# EasyEDA schematic SmartLightsMini.json
TITLE: Smart Lights (MINI); REV: 1.4; Date: 2022-04-09; Sheet: 1/1; Drawn By: VictorAlicino; Company: ALICINO
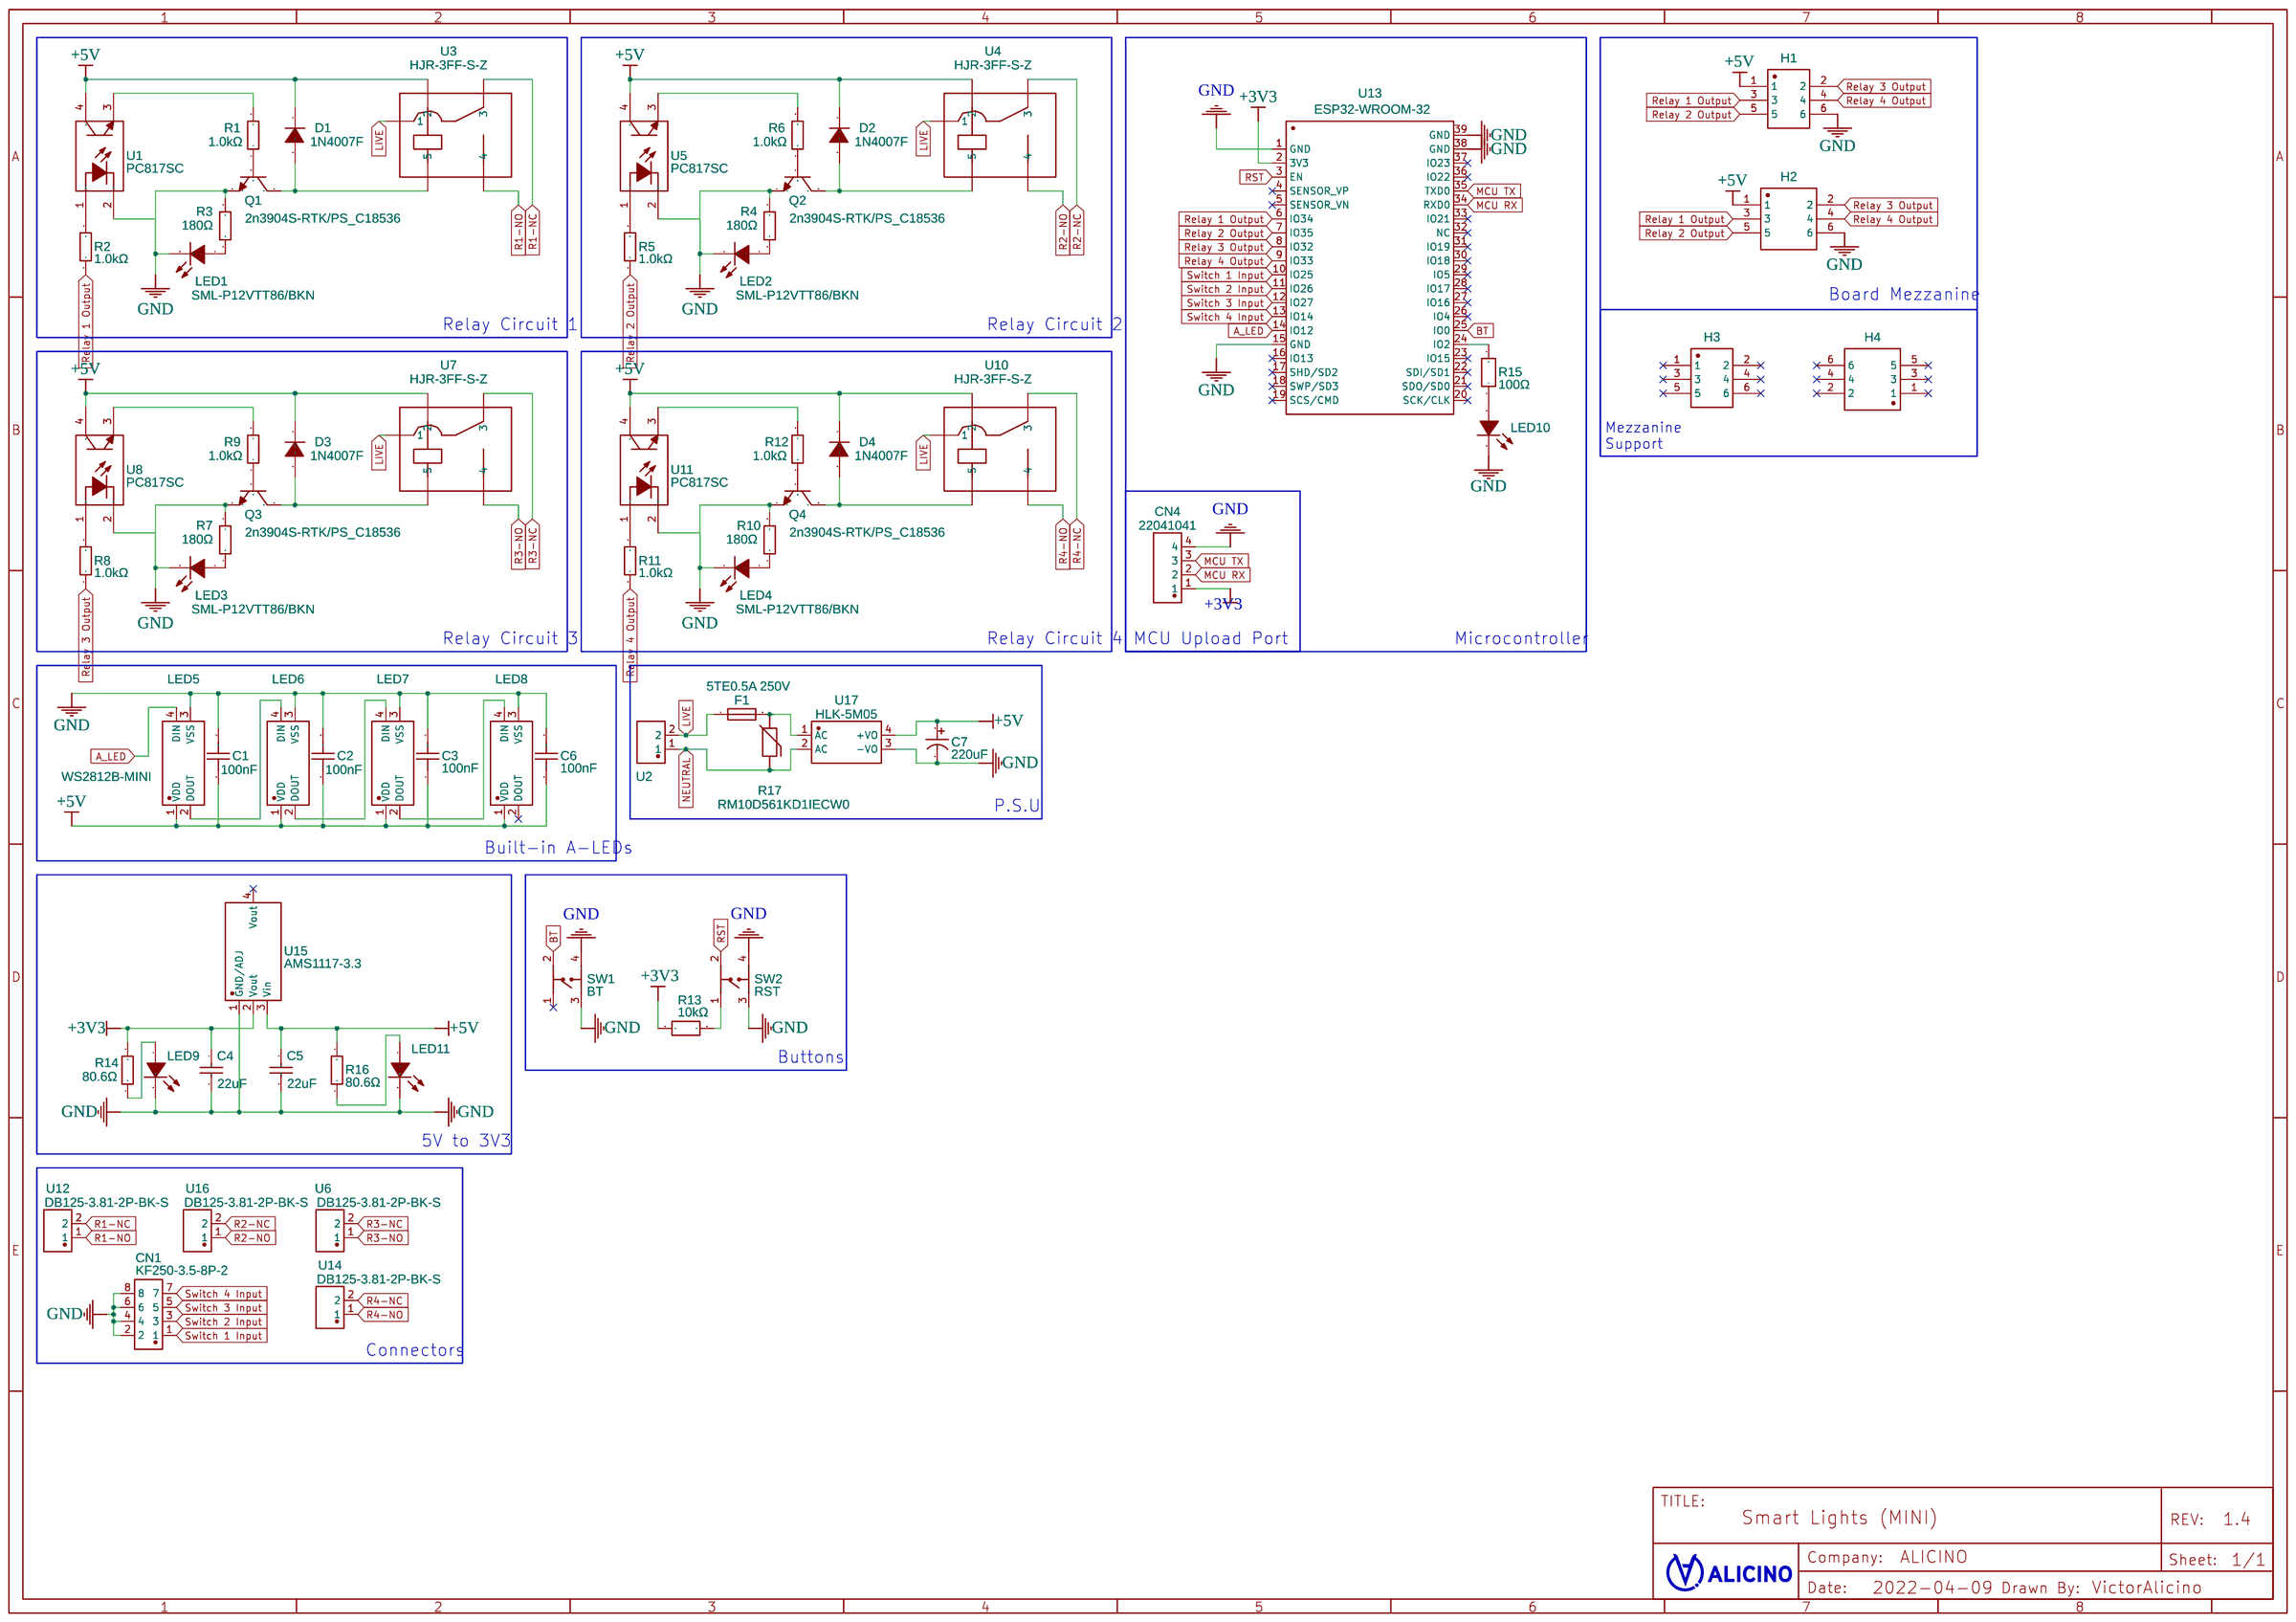
[diagram p0: schematic sheet]

## Parts
C1  100nF  [C0603]
C2  100nF  [C0603]
C3  100nF  [C0603]
C4  22uF  [C0603]
C5  22uF  [C0603]
C6  100nF  [C0603]
C7  220uF  [CAP-SMD_BD10.0-L10.3-W10.3-FD]
CN1  KF250-3.5-8P-2  [CONN-TH_8P-P3.50_KF250-3.5-8P-2]
CN4  22041041  [CONN-TH_22041041-1]
D1  1N4007F  [SMAF_L3.5-W2.6-LS4.7-RD]
D2  1N4007F  [SMAF_L3.5-W2.6-LS4.7-RD]
D3  1N4007F  [SMAF_L3.5-W2.6-LS4.7-RD]
D4  1N4007F  [SMAF_L3.5-W2.6-LS4.7-RD]
F1  5TE0.5A 250V  [FUSE-TH_L8.5-W4.0-P5.08-D0.6]
H1  210SMT-2*3P Gold-plated black  [HDR-SMD_6P-P2.54-V-M-R2-C3-S2.54-LS7.3]
H2  220S-2*3P H=8.5MM Ytype Gold-plated  [HDR-TH_6P-P2.54-V-F-R2-C3-S2.54]
H3  210SMT-2*3P Gold-plated black  [HDR-SMD_6P-P2.54-V-M-R2-C3-S2.54-LS7.3]
H4  220S-2*3P H=8.5MM Ytype Gold-plated  [HDR-TH_6P-P2.54-V-F-R2-C3-S2.54]
LED1  SML-P12VTT86/BKN  [LED0402-R-RD_RED]
LED2  SML-P12VTT86/BKN  [LED0402-R-RD_RED]
LED3  SML-P12VTT86/BKN  [LED0402-R-RD_RED]
LED4  SML-P12VTT86/BKN  [LED0402-R-RD_RED]
LED5  WS2812B-MINI  [LED-SMD_4P-L3.5-W3.5-TL_WS2812B]
LED6  WS2812B-MINI  [LED-SMD_4P-L3.5-W3.5-TL_WS2812B]
LED7  WS2812B-MINI  [LED-SMD_4P-L3.5-W3.5-TL_WS2812B]
LED8  WS2812B-MINI  [LED-SMD_4P-L3.5-W3.5-TL_WS2812B]
LED9  SML-P12VTT86/BKN  [LED0402-R-RD_RED]
LED10  19-21UYC/S530-A2/TR8  [LED0603-R-RD_YELLOW]
LED11  SML-P12VTT86/BKN  [LED0402-R-RD_RED]
Q1  2n3904S-RTK/PS_C18536  [SOT-23-3_L2.9-W1.3-P1.90-LS2.4-TR]
Q2  2n3904S-RTK/PS_C18536  [SOT-23-3_L2.9-W1.3-P1.90-LS2.4-TR]
Q3  2n3904S-RTK/PS_C18536  [SOT-23-3_L2.9-W1.3-P1.90-LS2.4-TR]
Q4  2n3904S-RTK/PS_C18536  [SOT-23-3_L2.9-W1.3-P1.90-LS2.4-TR]
R1  1.0kΩ  [R0603]
R2  1.0kΩ  [R0603]
R3  180Ω  [R0603]
R4  180Ω  [R0603]
R5  1.0kΩ  [R0603]
R6  1.0kΩ  [R0603]
R7  180Ω  [R0603]
R8  1.0kΩ  [R0603]
R9  1.0kΩ  [R0603]
R10  180Ω  [R0603]
R11  1.0kΩ  [R0603]
R12  1.0kΩ  [R0603]
R13  10kΩ  [R0603]
R14  80.6Ω  [R0603]
R15  100Ω  [R0603]
R16  80.6Ω  [R0603]
R17  RM10D561KD1IECW0  [RES-TH_L13.0-W6.5-P7.50-D1.2]
SW1  BT  [SW-SMD_4P-L6.0-W6.0-P4.50-LS8.6]
SW2  RST  [SW-SMD_4P-L6.0-W6.0-P4.50-LS8.6]
U1  PC817SC  [OPTO-SMD-4_L4.6-W6.5-P2.54-LS10.3-TL]
U2  DB125-3.81-2P-RD  [CONN-TH_DB125-3.81-2P-RD]
U3  HJR-3FF-S-Z  [HJR-3FF-S-Z 5V]
U4  HJR-3FF-S-Z  [HJR-3FF-S-Z 5V]
U5  PC817SC  [OPTO-SMD-4_L4.6-W6.5-P2.54-LS10.3-TL]
U6  DB125-3.81-2P-BK-S  [CONN-TH_2P-P3.81_DB125-3.81-2P-BK-S]
U7  HJR-3FF-S-Z  [HJR-3FF-S-Z 5V]
U8  PC817SC  [OPTO-SMD-4_L4.6-W6.5-P2.54-LS10.3-TL]
U10  HJR-3FF-S-Z  [HJR-3FF-S-Z 5V]
U11  PC817SC  [OPTO-SMD-4_L4.6-W6.5-P2.54-LS10.3-TL]
U12  DB125-3.81-2P-BK-S  [CONN-TH_2P-P3.81_DB125-3.81-2P-BK-S]
U13  ESP32-WROOM-32  [WIFIM-SMD_ESP-32S]
U14  DB125-3.81-2P-BK-S  [CONN-TH_2P-P3.81_DB125-3.81-2P-BK-S]
U15  AMS1117-3.3  [SOT-223-3_L6.5-W3.4-P2.30-LS7.0-BR]
U16  DB125-3.81-2P-BK-S  [CONN-TH_2P-P3.81_DB125-3.81-2P-BK-S]
U17  HLK-5M05  [PWRM-TH_HLK-5M05]

## Library data of the parts
C1-C3 C6 = 06035C104KAZ2A: Supplier: LCSC; Supplier Part: C212614; Manufacturer: AVX; Contributor: LCSC; JLCPCB Part Class: Extended Part
C4 C5 = 06036D226MAT2A: Supplier: LCSC; Manufacturer: AVX; Supplier Part: C140720; JLCPCB Part Class: Extended Part
C7 = EEEHA1C221AP: Supplier: LCSC; Supplier Part: C336793; Manufacturer: PANASONIC; Contributor: LCSC; JLCPCB Part Class: Extended Part
CN1 = KF250-3.5-8P-2: Supplier: LCSC; Supplier Part: C475169; Manufacturer: Cixi Kefa Elec; Contributor: LCSC; JLCPCB Part Class: Extended Part
CN4 = 22041041: Supplier: LCSC; Supplier Part: C185196; Manufacturer: MOLEX; Contributor: LCSC; JLCPCB Part Class: Extended Part
D1-D4 = 1N4007F: Supplier: LCSC; Manufacturer: SK; Supplier Part: C110856; JLCPCB Part Class: Extended Part
F1 = 5TE0.5A 250V: Supplier: LCSC; Supplier Part: C140483; Manufacturer: XC Elec(Shenzhen); Contributor: LCSC; JLCPCB Part Class: Extended Part
H1 H3 = 210SMT-2*3P Gold-plated black: Supplier: LCSC; Manufacturer: Ckmtw; Contributor: LCSC; Supplier Part: C124390; JLCPCB Part Class: Extended Part
H2 H4 = 220S-2*3P H=8.5MM Ytype Gold-plated: Supplier: LCSC; Manufacturer: Ckmtw; Contributor: LCSC; Supplier Part: C124421; JLCPCB Part Class: Extended Part
LED1-LED4 LED9 LED11 = SML-P12VTT86/BKN: Supplier: LCSC; Supplier Part: C184649; Manufacturer: ROHM Semicon; Contributor: LCSC; JLCPCB Part Class: Extended Part
LED5-LED8 = WS2812B-MINI: Supplier: LCSC; Supplier Part: C527089; Manufacturer: Worldsemi; Manufacturer Part: WS2812B-Mini; Contributor: LCSC; JLCPCB Part Class: Extended Part
LED10 = 19-21UYC/S530-A2/TR8: Supplier: LCSC; Supplier Part: C90109; Manufacturer: Everlight Elec; Contributor: LCSC; JLCPCB Part Class: Extended Part
Q1-Q4 = 2n3904S-RTK/PS_C18536: Supplier: LCSC; Manufacturer: KEC; Manufacturer Part: 2n3904S-RTK/PS; Supplier Part: C18536; JLCPCB Part Class: Extended Part
R1 R2 R5 R6 R8 R9 R11 R12 = AECR0603F1K00K9: Supplier: LCSC; Supplier Part: C328340; Manufacturer: ResistorToday; Resistance (Ohms): 1K; Contributor: LCSC; JLCPCB Part Class: Extended Part
R3 R4 R7 R10 = AECR0603F180RK9: Supplier: LCSC; Supplier Part: C352360; Manufacturer: ResistorToday; Resistance (Ohms): 180; Contributor: LCSC; JLCPCB Part Class: Extended Part
R13 = PTFR0603D10K0P9: Supplier: LCSC; Supplier Part: C375971; Manufacturer: ResistorToday; Resistance (Ohms): 10K; Contributor: LCSC; JLCPCB Part Class: Extended Part
R14 R16 = HPCR0603F80R6K9: Supplier: LCSC; Supplier Part: C365216; Manufacturer: ResistorToday; Resistance (Ohms): 80.6; Contributor: LCSC; JLCPCB Part Class: Extended Part
R15 = PTFR0603B100RN9: Supplier: LCSC; Supplier Part: C394538; Manufacturer: ResistorToday; Contributor: LCSC; Resistance (Ohms): 100; JLCPCB Part Class: Extended Part
R17 = RM10D561KD1IECW0: Supplier: LCSC; Supplier Part: C253970; Manufacturer: Dersonic; Contributor: LCSC; JLCPCB Part Class: Extended Part
SW1 SW2 = TSD003A04526A02: Supplier: LCSC; Supplier Part: C2888576; Manufacturer: BZCN(博众电气); Contributor: LCSC; JLCPCB Part Class: Extended Part
U1 U5 U8 U11 = PC817SC: Supplier: LCSC; Supplier Part: C115502; Manufacturer: Wuxi China Resources Huajing Microelectronics; Contributor: LCSC; JLCPCB Part Class: Extended Part
U2 = DB125-3.81-2P-RD: Supplier: LCSC; Supplier Part: C881703; Manufacturer: DIBO; Contributor: LCSC; JLCPCB Part Class: Extended Part
U3 U4 U7 U10 = HJR-3FF-S-Z: Manufacturer: TBO; Manufacturer Part: 1366512; Supplier Part: 1366512; Supplier: Conrad; link: https://www.conrad.at/de/p/tianbo-electronics-hjr-3ff-s-z-5vdc-printrelais-5-v-dc-15-a-1-wechsler-1-st-1366512.html; Contributor: deathstepdspw
U6 U12 U14 U16 = DB125-3.81-2P-BK-S: Supplier: LCSC; Supplier Part: C430618; Manufacturer: DIBO; Contributor: LCSC; JLCPCB Part Class: Extended Part
U13 = ESP32-WROOM-32: Supplier: LCSC; Supplier Part: C82899; Manufacturer: Espressif Systems; Contributor: LCSC; JLCPCB Part Class: Extended Part
U15 = AMS1117-3.3: sourceId: dwIGgezVh; Supplier: LCSC; Manufacturer: AMS; Supplier Part: C6186; JLCPCB Part Class: Basic Part
U17 = HLK-5M05: Supplier: LCSC; Supplier Part: C209907; Manufacturer: HI-LINK; Contributor: LCSC; JLCPCB Part Class: Extended Part

## Nets
+3V3: C4.1 CN4.1 R13.1 R14.2 U13.2(3V3) U15.2(Vout)
+5V: C1.1 C2.1 C3.1 C5.2 C6.1 C7.1 D1.1(C) D2.1(C) D3.1(C) D4.1(C) H1.1 H2.1 LED5.1(VDD) LED6.1(VDD) LED7.1(VDD) LED8.1(VDD) R16.2 U1.4(COL) U3.2 U4.2 U5.4(COL) U7.2 U8.4(COL) U10.2 U11.4(COL) U15.3(Vin) U17.4(+VO)
GND: C1.2 C2.2 C3.2 C4.2 C5.1 C6.2 C7.2 CN1.2 CN1.4 CN1.6 CN1.8 CN4.4 H1.6 H2.6 LED1.2(C) LED2.2(C) LED3.2(C) LED4.2(C) LED5.3(VSS) LED6.3(VSS) LED7.3(VSS) LED8.3(VSS) LED9.2(C) LED10.2(K) LED11.2(C) Q1.1(E) Q2.1(E) Q3.1(E) Q4.1(E) R3.2 R4.2 R7.2 R10.2 SW1.3 SW1.4 SW2.3 SW2.4 U1.2(CAT) U5.2(CAT) U8.2(CAT) U11.2(CAT) U13.1(GND) U13.15(GND) U13.38(GND) U13.39(GND) U15.1(GND/ADJ) U17.3(-VO)
A_LED: LED5.4(DIN) U13.14(IO12)
BT: SW1.2 U13.25(IO0)
LIVE: F1.1 U2.2 U3.1 U4.1 U7.1 U10.1
MCU RX: CN4.2 U13.34(RXD0)
MCU TX: CN4.3 U13.35(TXD0)
NEUTRAL: R17.1 U2.1 U17.2(AC)
R1-NC: U3.3 U12.2
R1-NO: U3.4 U12.1
R2-NC: U4.3 U16.2
R2-NO: U4.4 U16.1
R3-NC: U6.2 U7.3
R3-NO: U6.1 U7.4
R4-NC: U10.3 U14.2
R4-NO: U10.4 U14.1
Relay 1 Output: H1.3 H2.3 R2.1 U13.6(IO34)
Relay 2 Output: H1.5 H2.5 R5.1 U13.7(IO35)
Relay 3 Output: H1.2 H2.2 R8.1 U13.8(IO32)
Relay 4 Output: H1.4 H2.4 R11.1 U13.9(IO33)
RST: SW2.2 U13.3(EN)
Switch 1 Input: CN1.1 U13.10(IO25)
Switch 2 Input: CN1.3 U13.11(IO26)
Switch 3 Input: CN1.5 U13.12(IO27)
Switch 4 Input: CN1.7 U13.13(IO14)
Net-(D1-2): D1.2(A) Q1.3(C) U3.5
Net-(D2-2): D2.2(A) Q2.3(C) U4.5
Net-(D3-2): D3.2(A) Q3.3(C) U7.5
Net-(D4-2): D4.2(A) Q4.3(C) U10.5
Net-(F1-2): F1.2 R17.2 U17.1(AC)
Net-(LED1-1): LED1.1(A) R3.1
Net-(LED2-1): LED2.1(A) R4.1
Net-(LED3-1): LED3.1(A) R7.1
Net-(LED4-1): LED4.1(A) R10.1
Net-(LED5-2): LED5.2(DOUT) LED6.4(DIN)
Net-(LED6-2): LED6.2(DOUT) LED7.4(DIN)
Net-(LED7-2): LED7.2(DOUT) LED8.4(DIN)
Net-(LED9-1): LED9.1(A) R14.1
Net-(LED10-1): LED10.1(A) R15.1
Net-(LED11-1): LED11.1(A) R16.1
Net-(Q1-2): Q1.2(B) R1.1
Net-(Q2-2): Q2.2(B) R6.1
Net-(Q3-2): Q3.2(B) R9.1
Net-(Q4-2): Q4.2(B) R12.1
Net-(R1-2): R1.2 U1.3(EM)
Net-(R2-2): R2.2 U1.1(AN)
Net-(R5-2): R5.2 U5.1(AN)
Net-(R6-2): R6.2 U5.3(EM)
Net-(R8-2): R8.2 U8.1(AN)
Net-(R9-2): R9.2 U8.3(EM)
Net-(R11-2): R11.2 U11.1(AN)
Net-(R12-2): R12.2 U11.3(EM)
Net-(R13-2): R13.2 SW2.1
Net-(R15-2): R15.2 U13.24(IO2)

Not connected (* = marked no-connect by the designer): H3 1* 2* 3* 4* 5* 6*; H4 1* 2* 3* 4* 5* 6*; LED8 2(DOUT)*; SW1 1*; U13 4(SENSOR_VP)* 5(SENSOR_VN)* 16(IO13)* 17(SHD/SD2)* 18(SWP/SD3)* 19(SCS/CMD)* 20(SCK/CLK)* 21(SDO/SD0)* 22(SDI/SD1)* 23(IO15)* 26(IO4)* 27(IO16)* 28(IO17)* 29(IO5)* 30(IO18)* 31(IO19)* 32(NC)* 33(IO21)* 36(IO22)* 37(IO23)*; U15 4(Vout)*

## Notes on the sheet
- Board Mezzanine
- Relay Circuit 1
- Relay Circuit 2
- Mezzanine
  Support
- Relay Circuit 3
- Relay Circuit 4
- MCU Upload Port
- Microcontroller
- P.S.U
- Built-in A-LEDs
- Buttons
- 5V to 3V3
- Connectors
